# EAGLE design ArduinoFuel9d (EAGLE 5.10)
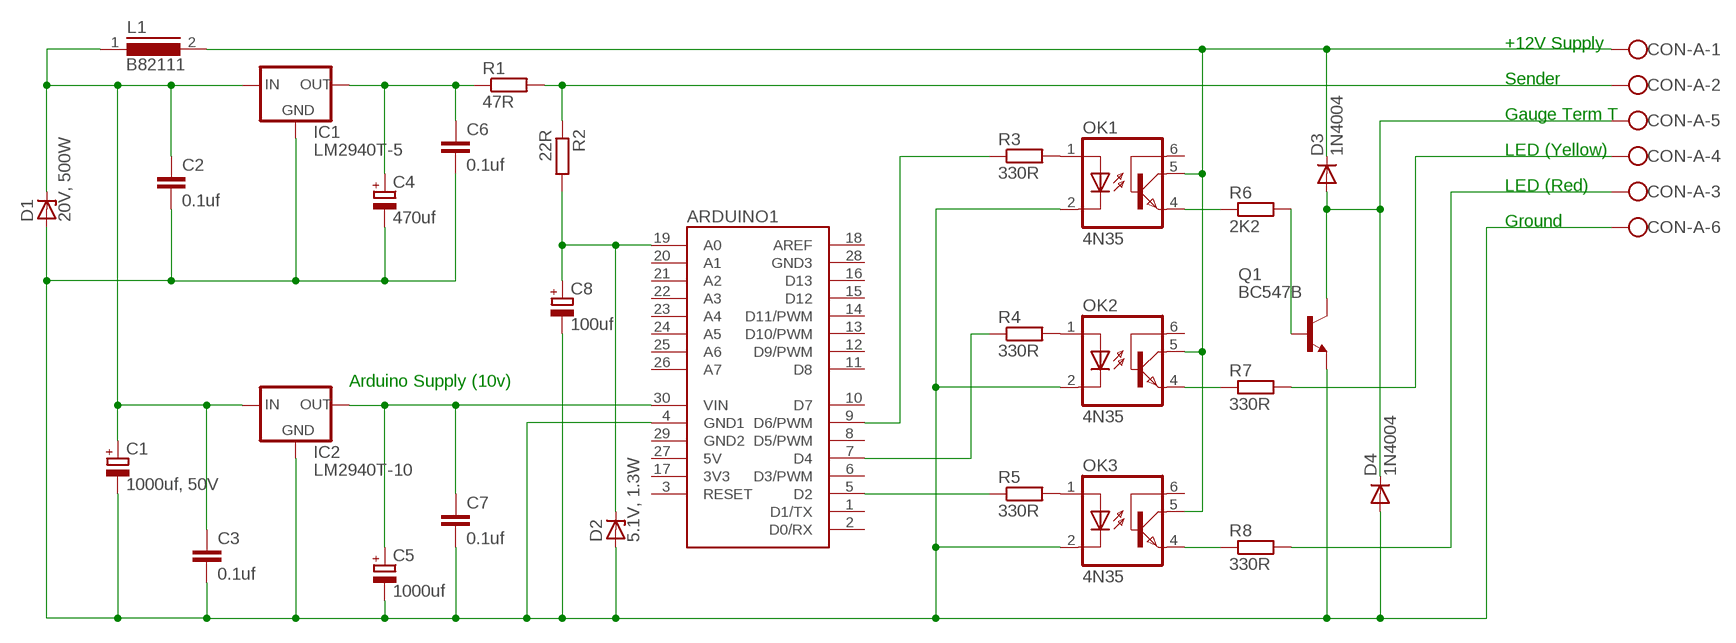
[diagram p0: schematic, sheet 1]

## Parts
ARDUINO1  ARDUINO_NANO  [ARDUINO_NANO]
C1  1000uf, 50V  CPOL-EUE7.5-16  [E7,5-16]
C2  0.1uf  C-EU050-024X044  [C050-024X044]
C3  0.1uf  C-EU050-024X044  [C050-024X044]
C4  470uf  CPOL-EUE5-10.5  [E5-10,5]
C5  1000uf  CPOL-EUE5-13  [E5-13]
C6  0.1uf  C-EU050-024X044  [C050-024X044]
C7  0.1uf  C-EU050-024X044  [C050-024X044]
C8  100uf  CPOL-EUE2.5-7  [E2,5-7]
CON-A  W237-6  [W237-6]
D1  20V, 500W  ZENER-DIODEC1702-15  [C1702-15]
D2  5.1V, 1.3W  ZENER-DIODEC1702-15  [C1702-15]
D3  1N4004  [DO41-10]
D4  1N4004  [DO41-10]
IC1  LM2940T-5  78XXL  [78XXL]
IC2  LM2940T-10  78XXL  [78XXL]
L1  B82111  [SUKW1-30]
OK1  4N35  [DIL06]
OK2  4N35  [DIL06]
OK3  4N35  [DIL06]
Q1  BC547B  [TO92]
R1  47R  R-EU_0204/7  [0204/7]
R2  22R  R-EU_0204/7  [0204/7]
R3  330R  R-EU_0204/7  [0204/7]
R4  330R  R-EU_0204/7  [0204/7]
R5  330R  R-EU_0204/7  [0204/7]
R6  2K2  R-EU_0204/7  [0204/7]
R7  330R  R-EU_0204/7  [0204/7]
R8  330R  R-EU_0204/7  [0204/7]

## Nets
N$2: C4.+ C6.1 IC1.OUT R1.1
N$3: ARDUINO1.5(D2) R5.1
N$4: ARDUINO1.9(D6/PWM) R3.1
N$5: OK2.4(EMI) R7.1
N$6: CON-A.2 R1.2 R2.1
N$7: OK1.4(EMI) R6.1
N$8: OK3.4(EMI) R8.1
N$10: CON-A.5 D3.A D4.C Q1.3(C)
N$11: ARDUINO1.30(VIN) C5.+ C7.1 IC2.OUT
N$12: Q1.2(B) R6.2
N$13: OK1.1(A) R3.2
N$14: OK3.1(A) R5.2
N$15: CON-A.1 D3.C L1.2 OK1.5(COL) OK2.5(COL) OK3.5(COL)
N$16: ARDUINO1.7(D4) R4.1
N$18: OK2.1(A) R4.2
N$19: CON-A.4 R7.2
N$21: CON-A.3 R8.2
N$22: ARDUINO1.19(A0) C8.+ D2.C R2.2
N$23: C1.+ C2.1 C3.1 D1.C IC1.IN IC2.IN L1.1
N$24: ARDUINO1.4(GND1) C1.- C2.2 C3.2 C4.- C5.- C6.2 C7.2 C8.- CON-A.6 D1.A D2.A D4.A IC1.GND IC2.GND OK1.2(C) OK2.2(C) OK3.2(C) Q1.1(E)
Unconnected: ARDUINO1.1(D1/TX) ARDUINO1.2(D0/RX) ARDUINO1.3(RESET) ARDUINO1.6(D3/PWM) ARDUINO1.8(D5/PWM) ARDUINO1.10(D7) ARDUINO1.11(D8) ARDUINO1.12(D9/PWM) ARDUINO1.13(D10/PWM) ARDUINO1.14(D11/PWM) ARDUINO1.15(D12) ARDUINO1.16(D13) ARDUINO1.18(AREF) ARDUINO1.20(A1) ARDUINO1.21(A2) ARDUINO1.22(A3) ARDUINO1.23(A4) ARDUINO1.24(A5) ARDUINO1.25(A6) ARDUINO1.26(A7) ARDUINO1.28(GND3) OK1.6(BAS) OK2.6(BAS) OK3.6(BAS)

## Notes on the sheet
- +12V Supply
- Sender
- Gauge Term T
- LED (Yellow)
- LED (Red)
- Ground
- Arduino Supply (10v)

## Power pins joined to a net without a drawn wire
3V3: ARDUINO1.17(3V3)
5V: ARDUINO1.27(5V)
GND2: ARDUINO1.29(GND2)

## Library data of the parts
ARDUINO1 = arduino-1:ARDUINO_NANO: Arduino Nano I/O pin arrangement
C1 C4 C5 C8 = resistor:CPOL-EU: POLARIZED CAPACITOR, European symbol
C2 C3 C6 C7 = rcl:C-EU: CAPACITOR, European symbol
CON-A = con-wago-500:W237-6: WAGO SCREW CLAMP
D1 D2 = diode:ZENER-DIODE: Z-Diode
D3 D4 = diode:1N4004: DIODE general purpose rectifier, 1 A
IC1 IC2 = v-reg:78XXL: VOLTAGE REGULATOR
L1 = inductors:B82111: INDUCTOR
OK1-OK3 = optocoupler:4N35: MOTOROLA OPTO COUPLER
Q1 = transistor-npn:BC547*: NPN Transistor
R1-R8 = resistor:R-EU_: RESISTOR, European symbol

## Board
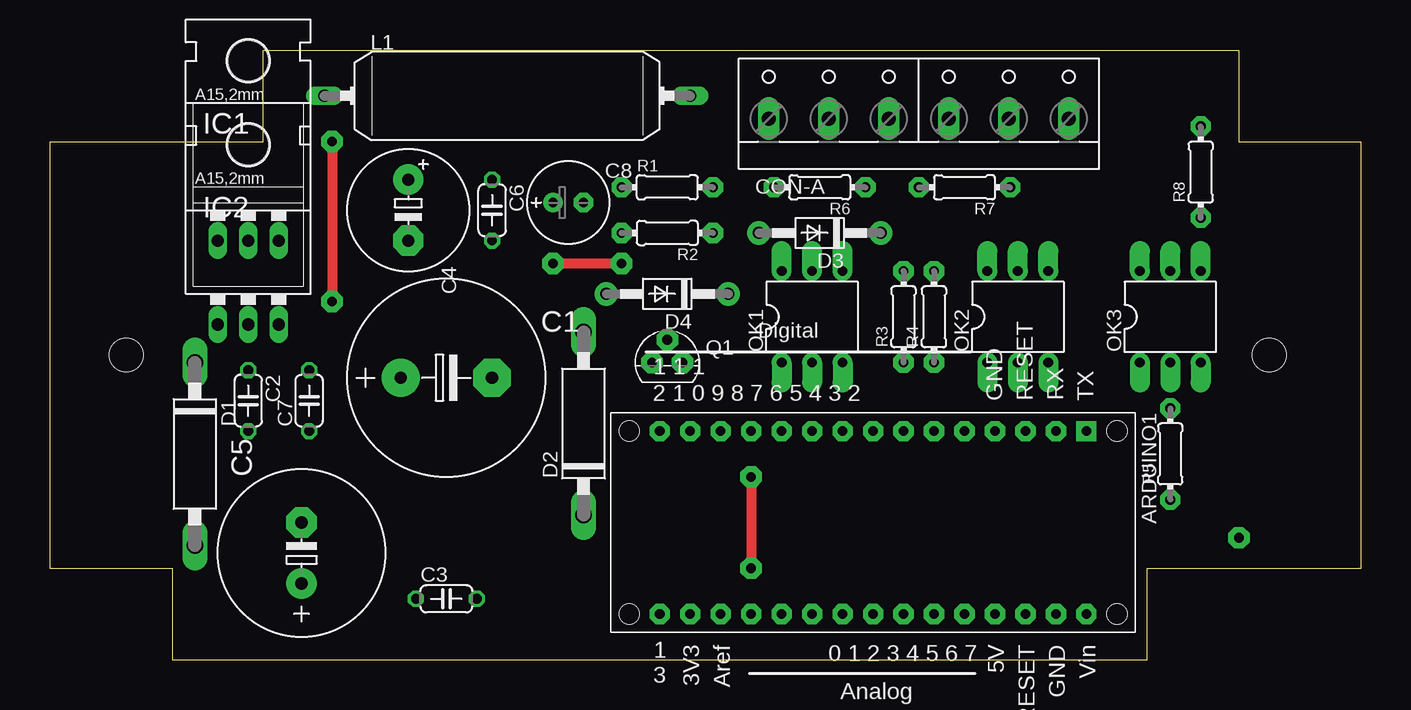
[diagram p1: board, top side]
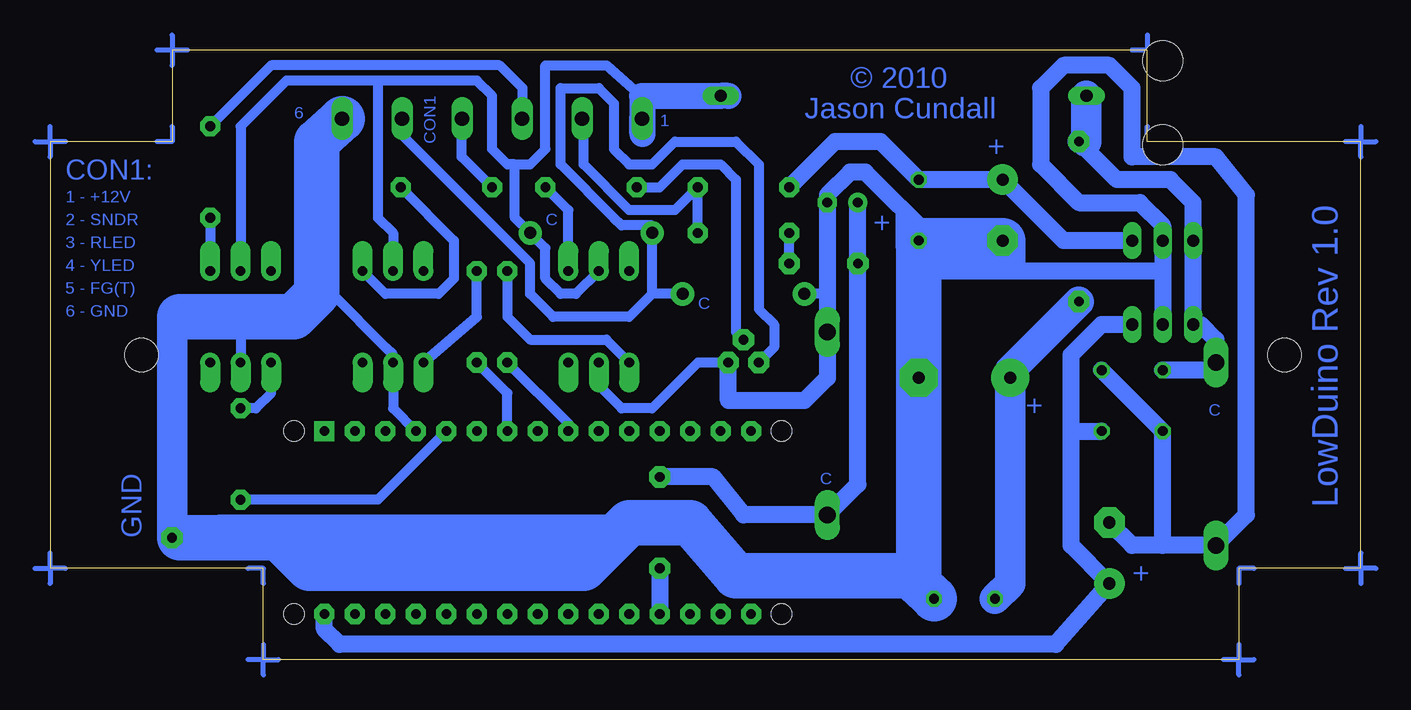
[diagram p2: board, bottom side, seen from below]

Size 109.22 x 50.8 mm. Coordinates in mm from the lower left corner, seen from the top.
Outline: 0,7.62 10.16,7.62 10.16,0 91.44,0 91.44,7.62 109.22,7.62 109.22,43.18 99.06,43.18 99.06,50.8 17.78,50.8 17.78,43.18 0,43.18 0,7.62
Copper layers (1*16): Top 0.035mm / dielectric 1.5mm / Bottom 0.035mm
Design rules "default": minimum track width 10mil, minimum drill 24mil, track to track 8mil, track to pad 8mil, pad to pad 8mil, via to via 8mil, smd to smd 8mil, copper to edge 40mil, drill to drill 8mil, minimum pad ring 10mil, minimum via ring 8mil, stop-mask expansion 4mil, vias tented up to drill 0mil, thermal gap 10mil
Holes 2.8 mm at 6.35,25.4 101.6,25.4

### Footprints (pad centres in the part's own frame; a part is rotated, then mirrored left to right if it is on the bottom)
ARDUINO_NANO = drill 0.8 pad 1.676 square: 1 0,-2.54 | drill 0.8 pad 1.676 octagon: 2 0,-5.08; 3 0,-7.62; 4 0,-10.16; 5 0,-12.7; 6 0,-15.24; 7 0,-17.78; 8 0,-20.32; 9 0,-22.86; 10 0,-25.4; 11 0,-27.94; 12 0,-30.48; 13 0,-33.02; 14 0,-35.56; 15 0,-38.1; 16 15.24,-38.1; 17 15.24,-35.56; 18 15.24,-33.02; 19 15.24,-30.48; 20 15.24,-27.94; 21 15.24,-25.4; 22 15.24,-22.86; 23 15.24,-20.32; 24 15.24,-17.78; 25 15.24,-15.24; 26 15.24,-12.7; 27 15.24,-10.16; 28 15.24,-7.62; 29 15.24,-5.08; 30 15.24,-2.54 | hole 1.676: 0,0; 0,-40.64; 15.24,-40.64; 15.24,0
E7,5-16 = drill 1.016 pad 3.15 round: + -3.81,0 | drill 1.016 pad 3.15 octagon: - 3.81,0
C050-024X044 = drill 0.813 octagon: 1 -2.54,0; 2 2.54,0
E5-10,5 = drill 1.016 pad 2.54 round: + -2.54,0 | drill 1.016 pad 2.54 octagon: - 2.54,0
E5-13 = drill 1.016 pad 2.54 round: + -2.54,0 | drill 1.016 pad 2.54 octagon: - 2.54,0
E2,5-7 = drill 0.813 pad 1.6 round: + -1.27,0 | drill 0.813 pad 1.6 octagon: - 1.27,0
W237-6 = drill 1.194 long: 1 -12.5,-1.27; 2 -7.5,-1.27; 3 -2.5,-1.27; 4 2.5,-1.27; 5 7.5,-1.27; 6 12.5,-1.27
C1702-15 = drill 1.397 long: A 7.62,0; C -7.62,0
DO41-10 = drill 1 pad 1.93 round: A 5.08,0; C -5.08,0
78XXL = drill 1.016 long: GND 0,-3.81; IN -2.54,-3.81; OUT 2.54,-3.81 | hole 3.302: 0,11.176
SUKW1-30 = drill 1.016 long: 1 -15.24,0; 2 15.24,0
DIL06 = drill 0.813 pad 1.676 offset: 1 -2.54,-3.81; 2 0,-3.81; 3 2.54,-3.81; 4 2.54,3.81; 5 0,3.81; 6 -2.54,3.81
TO92 = drill 0.813 pad 1.778 octagon: 1 1.27,0; 2 0,1.905; 3 -1.27,0
0204/7 = drill 0.813 pad 1.676 octagon: 1 -3.81,0; 2 3.81,0

### Placement (x,y rotation side)
ARDUINO1  88.9,19.05 270 top
C1  33.02,23.5 0 top
C2  16.51,21.59 270 top
C3  33.02,5.08 0 top
C4  29.84,37.47 270 top
C5  20.95,8.89 90 top
C6  36.83,37.47 270 top
C7  21.59,21.59 90 top
C8  43.18,38.1 0 top
CON-A  72.39,46.35 0 top
D1  12.06,17.14 270 top
D2  44.45,19.68 90 top
D3  64.14,35.56 180 top
D4  51.44,30.48 180 top
IC1  16.51,38.73 0 top
IC2  16.51,31.75 0 top
L1  38.1,46.99 0 top
OK1  63.5,28.57 0 top
OK2  80.64,28.57 0 top
OK3  93.34,28.57 0 top
Q1  51.44,24.77 0 top
R1  51.44,39.37 0 top
R2  51.44,35.56 180 top
R3  71.12,28.57 90 top
R4  73.66,28.57 90 top
R5  93.34,17.14 90 top
R6  64.14,39.37 180 top
R7  76.2,39.37 180 top
R8  95.89,40.64 90 top

### Tracks (layer width: path | path; a pad name or v marks a point on that pad's centre or on a via)
N$2
  Bottom 1.422: IC1.OUT 24.77,34.92 C4.+ C6.1 40.01,43.18 43.81,43.18 R1.1
N$3
  Bottom 0.813: R5.1 81.92,13.34 ARDUINO1.5
N$4
  Bottom 0.813: ARDUINO1.9 66.04,19.68 R3.1
N$5
  Bottom 0.813: R7.1 75.56,34.92 75.56,31.75 76.83,30.48 81.28,30.48 OK2.4
N$6
  Bottom 0.813: CON-A.2 64.77,45.09 64.77,41.27 60.96,37.47 57.15,37.47 R1.2 R2.1
N$7
  Bottom 0.813: OK1.4 66.04,37.47 R6.1
N$8
  Bottom 0.813: R8.1 OK3.4
N$10
  Bottom 0.813: 59.05,30.48 60.96,28.57 67.31,28.57 69.22,30.48 69.22,33.02 80.01,43.81 CON-A.5 | D4.C 59.05,30.48 | 59.05,30.48 D3.A 59.05,36.2 61.59,36.2 62.23,36.83 66.67,41.27 66.67,47.62 63.5,47.62 62.23,46.35 62.23,42.55 60.96,41.27 59.05,41.27 57.15,43.18 52.07,43.18 50.16,41.27 50.16,29.21 48.9,27.94 48.9,26.04 Q1.3
N$11
  Bottom 1.422: 24.13,19.05 C7.1 | 24.13,19.05 24.13,9.53 C5.+ 25.4,1.27 85.09,1.27 86.36,2.54 ARDUINO1.30 | IC2.OUT 21.59,27.94 24.13,25.4 24.13,19.05
N$12
  Bottom 0.813: R6.2 58.42,39.37 56.52,41.27 53.34,41.27 52.07,40.01 52.07,27.3 Q1.2
N$13
  Bottom 0.813: R3.2 71.12,28.57 69.22,26.67 62.87,26.67 OK1.1
N$14
  Bottom 0.813: OK3.1 90.81,22.23 92.08,20.95 R5.2
N$15
  Bottom 0.813: OK3.5 93.34,44.45 89.53,48.26 81.92,48.26 | 81.92,48.26 81.92,36.83 80.64,35.56 OK2.5 | 70.48,41.27 69.22,41.27 67.94,42.55 67.94,49.53 62.87,49.53 59.87,46.88 | 70.48,41.27 71.12,41.27 72.39,42.55 72.39,46.99 73.66,48.26 81.92,48.26 | 70.48,41.27 70.48,36.83 D3.C 67.94,34.29 67.94,31.75 66.67,30.48 65.41,30.48 OK1.5
  Bottom 2.184: 52.7,46.99 L1.2 59.89,46.99 59.87,46.88 59.87,43.81 CON-A.1
N$16
  Bottom 0.813: ARDUINO1.7 71.12,22.23 R4.1
N$18
  Bottom 0.813: OK2.1 73.66,28.57 R4.2
N$19
  Bottom 0.813: R7.2 74.93,41.91 CON-A.4
N$21
  Bottom 0.813: R8.2 90.81,49.53 71.75,49.53 69.85,47.62 CON-A.3
N$22  (via drill 0.8 pad 1.78)
  Top 0.813: v58.42,15.24 v58.42,7.62 | v41.91,33.02 v47.62,33.02
  Bottom 0.813: v47.62,33.02 R2.2
  Bottom 1.422: C8.+ v41.91,33.02 41.91,14.61 D2.C 51.44,12.06 53.98,15.24 v58.42,15.24 | v58.42,7.62 ARDUINO1.19
N$23  (via drill 0.8 pad 1.78)
  Top 0.813: v23.5,43.18 v23.5,29.84
  Bottom 1.422: C2.1 12.7,24.13 D1.C 12.06,26.67 13.34,27.94 IC2.IN IC1.IN 13.97,38.1 15.88,40.01 20.32,40.01 v23.5,43.18 | 29.21,24.13 C1.+
  Bottom 1.93: v23.5,43.18 22.86,43.18
  Bottom 2.54: C1.+ 29.21,6.35 C3.1 | 22.86,43.18 L1.1 | v23.5,29.84 29.21,24.13
N$24  (via drill 0.8 pad 1.78)
  Bottom 0.813: 93.34,28.57 OK3.2 | 44.45,30.48 D4.A | 87,30.48 85.72,30.48 81.28,26.04 80.64,25.4 OK2.2 80.64,20.95 ARDUINO1.4 | OK1.2 63.5,22.86 61.59,20.95 59.05,20.95 55.24,24.77 Q1.1
  Bottom 1.422: C7.2 C2.2 16.51,9.53 | 16.51,9.53 D1.A 9.53,12.06 9.53,38.73 12.06,41.91 19.05,41.91 19.05,47.62 20.95,49.53 24.77,49.53 26.67,47.62 26.67,41.27 23.5,38.1 18.41,38.1 16.51,36.2 IC1.GND 16.51,32.38 | 16.51,9.53 19.05,9.53 C5.- | Q1.1 52.7,21.59 46.35,21.59 44.45,23.5 D2.A 44.45,30.48 C8.- 44.45,38.73 42.55,40.64 41.27,40.64 35.56,34.92 arc-90 C6.2 | 16.51,32.38 IC2.GND | 16.51,32.38 34.92,32.38 29.84,33.66
  Bottom 1.93: 98.42,28.57 93.34,28.57
  Bottom 2.54: 38.1,6.99 36.83,6.99 36.83,6.35 | 98.42,10.16 v99.06,10.16 99.06,28.57 98.42,28.57
  Bottom 3.81: CON-A.6 87,43.18 87,30.48 88.9,28.57 98.42,28.57 | 29.84,33.66 30.48,33.66 | 31.11,33.66 30.48,33.66 | 30.48,33.66 29.84,34.29 C4.- 35.56,34.92 C6.2 C1.- 36.83,6.99 | 36.83,6.35 C3.2 | 38.1,6.99 52.07,6.99 55.88,11.43 60.96,11.43 64.77,7.62 87.63,7.62 90.17,10.16 98.42,10.16
S$1  (via drill 0.6)
  other vias: 48.26,19.05
S$2  (via drill 0.6)
  other vias: 88.9,19.05
S$3  (via drill 0.6)
  other vias: 48.26,3.81
S$4  (via drill 0.6)
  other vias: 88.9,3.81
S$5  (via drill 0.6)
  other vias: 101.6,25.4
S$6  (via drill 0.6)
  other vias: 6.35,25.4
S$7
  Bottom 0.406: 97.79,50.8 100.33,50.8 | 99.06,43.18 100.33,43.18
S$8
  Bottom 0.406: 99.06,52.07 99.06,49.53 | 99.06,44.45 99.06,43.18
S$9
  Bottom 0.406: 107.95,43.18 109.22,43.18 | 110.49,43.18 109.22,43.18 | 109.22,43.18 109.22,44.45 | 109.22,43.18 109.22,41.91
S$10
  Bottom 0.406: 107.95,7.62 109.22,7.62 | 110.49,7.62 109.22,7.62 | 109.22,7.62 109.22,8.89 | 109.22,7.62 109.22,6.35
S$11
  Bottom 0.406: 91.44,6.35 91.44,7.62 92.71,7.62
S$12
  Bottom 0.406: 91.44,1.27 91.44,0 | 91.44,-1.27 91.44,0 | 91.44,0 90.17,0 | 91.44,0 92.71,0
S$13
  Bottom 0.406: 10.16,1.27 10.16,0 | 10.16,-1.27 10.16,0 | 10.16,0 8.89,0 | 10.16,0 11.43,0
S$14
  Bottom 0.406: 8.89,7.62 10.16,7.62 10.16,6.35
S$15
  Bottom 0.406: -1.27,7.62 0,7.62 | 1.27,7.62 0,7.62 | 0,7.62 0,8.89 | 0,7.62 0,6.35
S$16
  Bottom 0.406: 0,41.91 0,43.18 | 0,44.45 0,43.18 | 0,43.18 -1.27,43.18 | 0,43.18 1.27,43.18
S$17
  Bottom 0.406: 16.51,43.18 17.78,43.18 17.78,44.45
S$18
  Bottom 0.406: 17.78,49.53 17.78,50.8 | 17.78,52.07 17.78,50.8 | 17.78,50.8 16.51,50.8 | 17.78,50.8 19.05,50.8
(copper drawn outside any net)
  shapes: Bottom area x6

### Text on the board
Bottom: © 2010 | CON1 | Jason Cundall | 6 | 1 | + | CON1: | 1 - +12V | + | C | 2 - SNDR | 3 - RLED | 4 - YLED | 5 - FG(T) | C | 6 - GND | C | + | C | LowDuino Rev 1.0 | GND | +